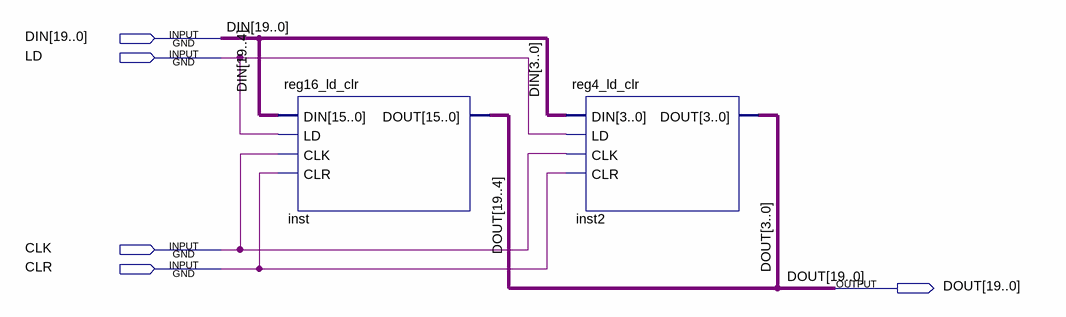
[diagram p0: schematic sheet]
// Quartus schematic reg20_ld_clr.bdf as structural Verilog: 2 symbols, 5 pins
module reg20_ld_clr (
  input  [19:0] DIN,
  input  LD,
  input  CLK,
  input  CLR,
  output [19:0] DOUT
);

  reg16_ld_clr inst (.DIN(DIN[19:4]), .LD(LD), .CLK(CLK), .CLR(CLR), .DOUT(DOUT[19:4]));
  reg4_ld_clr inst2 (.DIN(DIN[3:0]), .LD(LD), .CLK(CLK), .CLR(CLR), .DOUT(DOUT[3:0]));
endmodule
